# Altium schematic sheet 08_CoreBoard.SchDoc
size A3
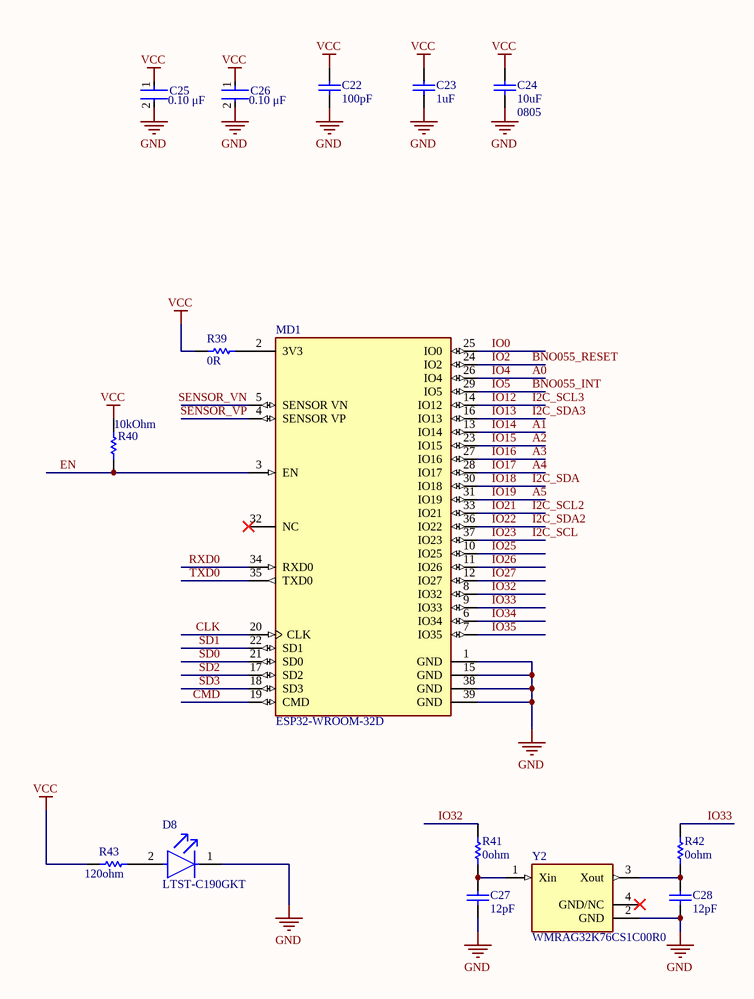
[diagram p0: 08_CoreBoard.SchDoc]

## Parts
C22  value 100pF  [CAPC1608X87X35LL15T15]  (hidden comment: C0603C101J1GACTU)
C23  value 1uF  [CAPC1608X87X35LL15T15]  (hidden comment: C0603C101J1GACTU)
C24  value 10uF  Package: 0805  [CAPC2013X135X50LL10T20]  (hidden comment: GRM21BR61C106KE15L)
C25  Capacitance: 0.10 μF  [FP-C0603C-CF-MFG]  (hidden comment: C0603C104M4RAC7411)
C26  Capacitance: 0.10 μF  [FP-C0603C-CF-MFG]  (hidden comment: C0603C104M4RAC7411)
C27  value 12pF  [CAPC1608X90X40NL10T20]  (hidden comment: CC0603JRNPO9BN120)
C28  value 12pF  [CAPC1608X90X40NL10T20]  (hidden comment: CC0603JRNPO9BN120)
D8  LTST-C190GKT  [FP-LTST-C190GKT-MFG]
MD1  ESP32-WROOM-32D  [FP-ESP32-WROOM-32D-MFG]
R39  value 0R  [RESC1608X55X25ML10T15]  (hidden comment: RC0603JR-070RL)
R40  Resistance: 10kOhm  [RESC1608X55X25ML10T15]  (hidden comment: RC0603JR-0710KL)
R41  value 0ohm  [RESC1608X55X25ML10T15]  (hidden comment: RC0603JR-070RL)
R42  value 0ohm  [RESC1608X55X25ML10T15]  (hidden comment: RC0603JR-070RL)
R43  value 120ohm  [RESC1608X55X30NL20T20]  (hidden comment: ERA-3AEB121V)
Y2  WMRAG32K76CS1C00R0  [FP-WMRAG32K76CS1C00R0-MFG]

## Nets
GND: C22.1 C23.1 C24.1 C25.2 C26.2 C27.1 C28.1 D8.1(C) MD1.1(GND) MD1.15(GND) MD1.38(GND) MD1.39(GND) Y2.2(GND)
VCC: C22.2 C23.2 C24.2 C25.1 C26.1 R39.1 R40.2 R43.1
A0: MD1.26(IO4)  [also labelled IO4]
A1: MD1.13(IO14)  [also labelled IO14]
A2: MD1.23(IO15)  [also labelled IO15]
A3: MD1.27(IO16)  [also labelled IO16]
A4: MD1.28(IO17)  [also labelled IO17]
A5: MD1.31(IO19)  [also labelled IO19]
BNO055_INT: MD1.29(IO5)  [also labelled IO5]
BNO055_RESET: MD1.24(IO2)  [also labelled IO2]
CLK: MD1.20(CLK)
CMD: MD1.19(CMD)
EN: MD1.3(EN) R40.1
I2C_SCL: MD1.37(IO23)  [also labelled IO23]
I2C_SCL2: MD1.33(IO21)  [also labelled IO21]
I2C_SCL3: MD1.14(IO12)  [also labelled IO12]
I2C_SDA: MD1.30(IO18)  [also labelled IO18]
I2C_SDA2: MD1.36(IO22)  [also labelled IO22]
I2C_SDA3: MD1.16(IO13)  [also labelled IO13]
IO0: MD1.25(IO0)
IO25: MD1.10(IO25)
IO26: MD1.11(IO26)
IO27: MD1.12(IO27)
IO32: MD1.8(IO32) R41.1
IO33: MD1.9(IO33) R42.1
IO34: MD1.6(IO34)
IO35: MD1.7(IO35)
RXD0: MD1.34(RXD0)
SD0: MD1.21(SD0)
SD1: MD1.22(SD1)
SD2: MD1.17(SD2)
SD3: MD1.18(SD3)
SENSOR_VN: MD1.5(SENSOR_VN)
SENSOR_VP: MD1.4(SENSOR_VP)
TXD0: MD1.35(TXD0)
NetC27_2: C27.2 R41.2 Y2.1(Xin)
NetC28_2: C28.2 R42.2 Y2.3(Xout)
NetD8_2: D8.2(A) R43.2
NetMD1_2: MD1.2(3V3) R39.2

Not connected (* = marked no-connect by the designer): MD1 32(NC)*; Y2 4(GND/NC)*

## Notes on the sheet
- Title
- Size:
- Date:
- A3
- Number:
- Time:
- Revision:
- Sheet
- of
- File:

## Library data of the parts
C22 C23 = CMP-2006-03318-1: Manufacturer: Kemet; Part Number: C0603C101J1GACTU
C24 = CMP-2007-03453-1: Manufacturer: Murata; Part Number: GRM21BR61C106KE15L
C25 C26 = CMP-03020-016578-1: CAP CER 0.1UF 16V X7R 0603; Manufacturer: KEMET; Tolerance: 0.2; Value: 0.10 μF; Automotive Grade: Grade 1; Material: Ceramic; Temperature Coefficient: 30ppm/°C; RoHS: TRUE; Temperature: -55°C to +125°C; Automotive: Yes; Device Class L3: Ceramic Capacitors; Temperature Characteristic: X7R; Package: C0603C-CF; Digikey Description: CAP CER 0.1UF 16V X7R 0603; Manufacturer Part Number: C0603C104M4RAC7411; ComponentLink2URL: https://api.kemet.com/component-edge/download/datasheet/C0603C100J5GACAUTO.pdf; Mouser Description: Multilayer Ceramic Capacitors MLCC - SMD/SMT 16volts 0.1uF X7R 20%; Voltage Rating: 16 V; Temperature Range High: +125°C; Temperature Range Low: -55°C; Height: 0.87mm; Device Class L1: Passive Components; ComponentLink2Description: Datasheet; Lead Free: Yes; Category: Cap; Device Class L2: Capacitors; Octopart: https://octopart.com/c0603c104m4rac7411-kemet-9138805
C27 C28 = CMP-1659-00031-1: Chip Capacitor, 12 pF, +/- 5%, 50 V, -55 to 125 degC, 0603 (1608 Metric), RoHS, Tape and Reel; Tolerance: 1%; Voltage Rating: 250 V; Case\Package: Axial; Power Rating: 250 mW; Resistance: 475 kohm; Mount: Through Hole; Length: 0.248 inch; PackageReference: 0603; DatasheetVersion: Rev. 14, 07/2016; Packaging: Bulk; Max Operating Temperature: 155 degC; Min Operating Temperature: -55 degC; ComponentLink2Description: Datasheet; ComponentLink2URL: http://www.yageo.com/NewPortal/yageodocoutput?fileName=/pdf/MLCC/UPY-GP_NP0_16V-to-50V_14.pdf; ComponentLink1URL: http://www.yageo.com/; PackageDescription: 2-Pin Surface Mount Device, Body 1.6 x 0.8 mm; Package Quantity: 200; RoHSCompliant: true; ComponentLink1Description: Manufacturer URL
D8 = CMP-22017-000005-1: LED GREEN CLEAR CHIP SMD; Reverse Voltage: 5V; Power Dissipation: 100mW; Forward Voltage: 2.1V; Test Current: 10mA; Number of LEDs: 1; Viewing Angle: 130°; Forward Current: 30mA; Voltage: 2V; Wavelength: 565nm; Dominant Wavelength: 569nm; Luminous Intensity: 6mcd; Lens Color: Colorless; Packaging: Tape and Reel; Lens Transparency: Clear; Min Operating Temperature: -55°C; Case Code (Metric): 1608; Lens Style: Clear; Case/Package: 0603; Mount: Surface Mount; Package Quantity: 1; Height: 0.8mm; Illumination Color: Green; Radiation Hardening: No; Depth: 0.8mm; Number of Pins: 2; Max Operating Temperature: 85°C; Color: Green; Number of Elements: 1; Power Rating: 100mW; Case Code (Imperial): 0603; Width: 0.8mm; Length: 1.6mm; Lead Free: Lead Free
MD1 = CMP-194065-000003-1: WIFI MODULE 32MBITS SPI FLASH; Manufacturer: Espressif Systems; Max Supply Voltage: 3.6V; Nominal Supply Current: 500mA; Max Frequency: 2484MHz; Number Of Adc Channels: 16; Number Of Gpio: 32; Interface: I2C,SPI,UART,Ethernet,I2S,Other; Data Rate: 150Mbits/s; Min Supply Voltage: 3V; Bandwidth: 72MHz; Sensitivity: -98dBm; Octopart: https://octopart.com/esp32-wroom-32d-espressif+systems-91040050; Package: ESP32-WROOM-32D; ComponentLink2URL: https://www.espressif.com/sites/default/files/documentation/esp32-wroom-32d_esp32-wroom-32u_datasheet_en.pdf; Lead Free: Yes; Category: UNK; Mouser Description: Wi-Fi/BT BLE Module ESP32-D0WD, SPI Flash, UART, P; Device Class L1: Integrated Circuits (ICs); RoHS: TRUE; Temperature Range Low: -40°C; ComponentLink2Description: Datasheet; Digikey Description: WIFI MODULE 32MBITS SPI FLASH; Height: 3.2mm; Temperature: -40°C to +85°C; Manufacturer Part Number: ESP32-WROOM-32D; Device Class L3: Transceivers; Device Class L2: RF Semiconductors and Devices; Temperature Range High: +85°C; Automotive: No
R39 R41 R42 = CMP-2100-03667-1: Chip Resistor, 0 Ohm, +/- 5%, 0.1 W, -55 to 155 degC, 0603 (1608 Metric), RoHS, Tape and Reel; Manufacturer: Yageo; Temperature Coefficient: 200ppm/degreesC; Voltage Rating: 50V; Power Rating: 100mW; Resistance: 0mOhm; Width: 0.8mm; Max Operating Temperature: 155degC; Tolerance: 5%; Package Reference: 0603; Height: 0.45mm; Depth: 0.8mm; Package Description: 2-Pin Surface Mount Device, Body 1.6 x 0.8 mm; Termination: SMD/SMT; Package Quantity: 5000; Case/Package: 0603; Case Code (Imperial): 0603; Radiation Hardening: No; Number of Pins: 2; Length: 1.6mm; Lead Free: LeadFree; Voltage Rating (DC): 50V; Military Standard: Not; Datasheet URL: http://www.yageo.com/NewPortal/yageodocoutput?fileName=/pdf/R-Chip/PYu-RC_Group_51_RoHS_L_5.pdf; Manufacturer URL: http://www.yageo.com/; Packaging: TapeandReel; Case Code (Metric): 1608; Min Operating Temperature: -55degC; Composition: ThickFilm; RoHSCompliant: true; Contact Plating: Tin; Datasheet Version: Rev. 5, 10/2016; REACH SVHC: NoSVHC
R40 = CMP-2000-05022-1: Resistor, 10 KOhm, +/- 5%, 100 mW, -55 to 155 degC, 0603 (1608 Metric), RoHS, Tape and Reel; Manufacturer: Yageo; Voltage Rating: 50V; Temperature Coefficient: 100PPM/C; Power Rating: 100mW; Package Reference: 603; Series: RC; Case Code - mm: 1608; Packaging: Reel; Datasheet URL: http://www.farnell.com/datasheets/443971.pdf; Datasheet Version: Rev. 4, 04/2009; Operating Temperature Range: -55Cto+155C; Product: ThickFilmResistorsGeneralPurpose; Package Description: 2-Pin Surface Mount Device, Body 1.6 x 0.8 mm; Manufacturer URL: http://www.yageo.com/; Case Code - in: 0603; Tolerance: 5%; Termination Style: SMD/SMT
R43 = CMP-2000-00896-1: Manufacturer: Panasonic; Part Number: ERA-3AEB121V
Y2 = CMP-06054-000002-1: MEMS Resonator; Manufacturer: Murata; Tolerance: 20ppm; Frequency: 32.768kHz; Esr: 75kΩ; Load Capacitance: 8pF; Temperature Range High: +85°C; Manufacturer Part Number: WMRAG32K76CS1C00R0; Device Class L2: Crystals / Oscillators; Category: Crys; ComponentLink2URL: https://www.murata.com/en-us/products/productdetail?partno=WMRAG32K76CS1C00R0; Package: WMRAG32K76CS1C00R0; Temperature: -30°C to +85°C; Automotive: No; Device Class L1: Passive Components; Octopart: https://octopart.com/wmrag32k76cs1c00r0-murata-103936783; ComponentLink2Description: Datasheet; RoHS: TRUE; Lead Free: Yes; Device Class L3: Crystals; Footprint Url: https://forum.upverter.com/uploads/default/original/3X/c/9/c928dfaf44ae48bfe51164a60c1d28063cd1860b.pdf; Temperature Range Low: -30°C